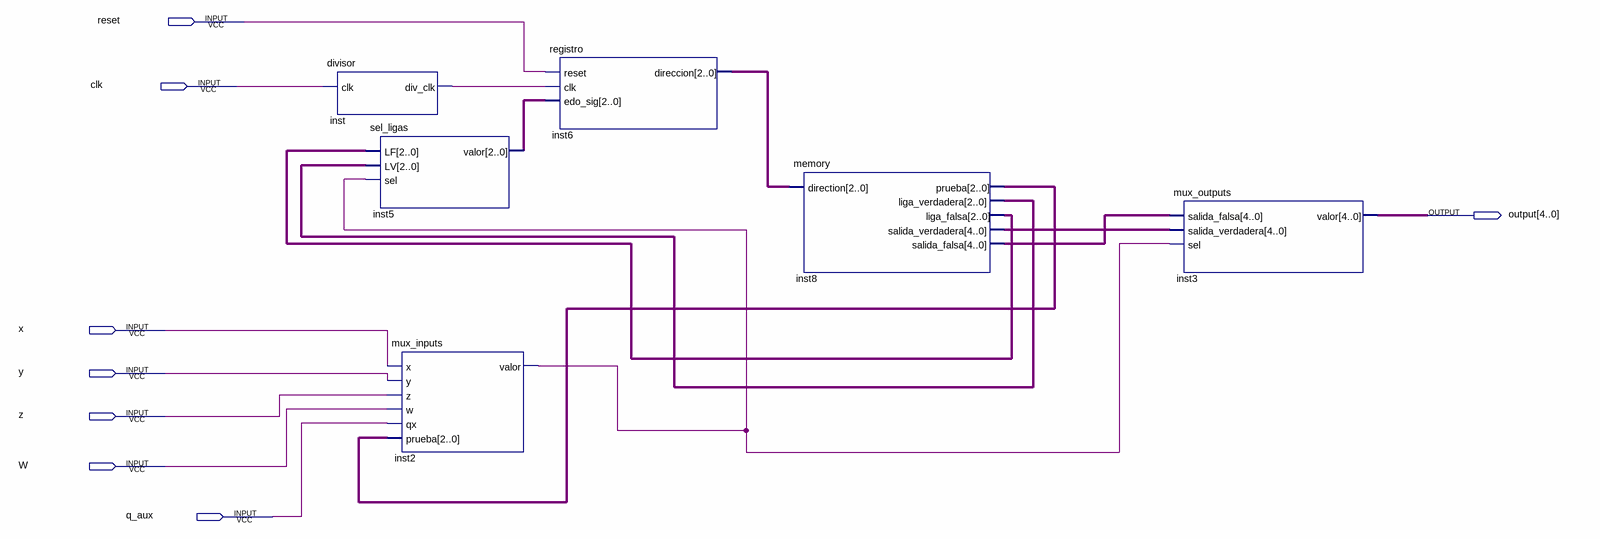
[diagram p0: schematic sheet]
// Quartus schematic main.bdf as structural Verilog: 6 symbols, 8 pins
module main (
  input  reset,
  input  clk,
  input  x,
  input  y,
  input  z,
  input  W,
  input  q_aux,
  output [4:0] \output 
);

  wire inst2_valor, inst_div_clk;
  wire [2:0] inst5_valor, inst6_direccion, inst8_liga_falsa, inst8_liga_verdadera, inst8_prueba;
  wire [4:0] inst8_salida_falsa, inst8_salida_verdadera;

  divisor inst (.clk(clk), .div_clk(inst_div_clk));
  sel_ligas inst5 (.LF(inst8_liga_falsa), .LV(inst8_liga_verdadera), .sel(inst2_valor), .valor(inst5_valor));
  mux_inputs inst2 (.x(x), .y(y), .z(z), .w(W), .qx(q_aux), .prueba(inst8_prueba), .valor(inst2_valor));
  registro inst6 (.reset(reset), .clk(inst_div_clk), .edo_sig(inst5_valor), .direccion(inst6_direccion));
  memory inst8 (
    .direction(inst6_direccion), .prueba(inst8_prueba), .liga_verdadera(inst8_liga_verdadera),
    .liga_falsa(inst8_liga_falsa), .salida_verdadera(inst8_salida_verdadera),
    .salida_falsa(inst8_salida_falsa));
  mux_outputs inst3 (
    .salida_falsa(inst8_salida_falsa), .salida_verdadera(inst8_salida_verdadera), .sel(inst2_valor),
    .valor(\output ));
endmodule
